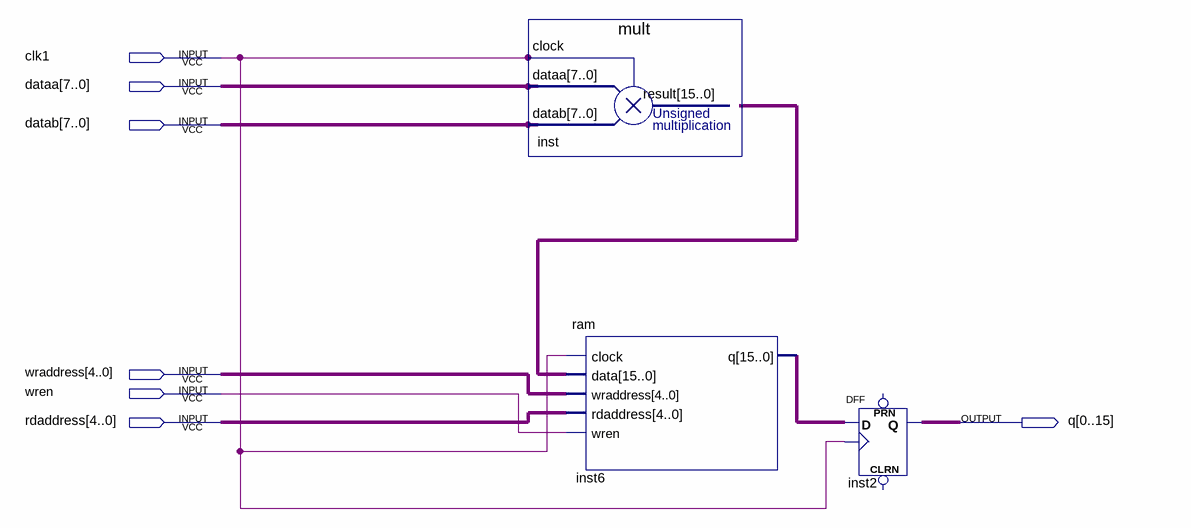
[diagram p0: schematic sheet]
// Quartus schematic pipemult.bdf as structural Verilog: 3 symbols, 7 pins
module pipemult (
  input  clk1,
  input  [7:0] dataa,
  input  [7:0] datab,
  input  [4:0] wraddress,
  input  wren,
  input  [4:0] rdaddress,
  output [0:15] q
);

  wire [15:0] inst6_q, inst_result;

  mult inst (.clock(clk1), .dataa(dataa), .datab(datab), .result(inst_result));
  ram inst6 (.clock(clk1), .data(inst_result), .wraddress(wraddress), .rdaddress(rdaddress), .wren(wren), .q(inst6_q));
  DFF inst2[15:0] (.CLK(clk1), .D(inst6_q), .Q(q));  // open: CLRN, PRN
endmodule
